# Altium project Test_Bench_Back_Scatter.PrjPcb
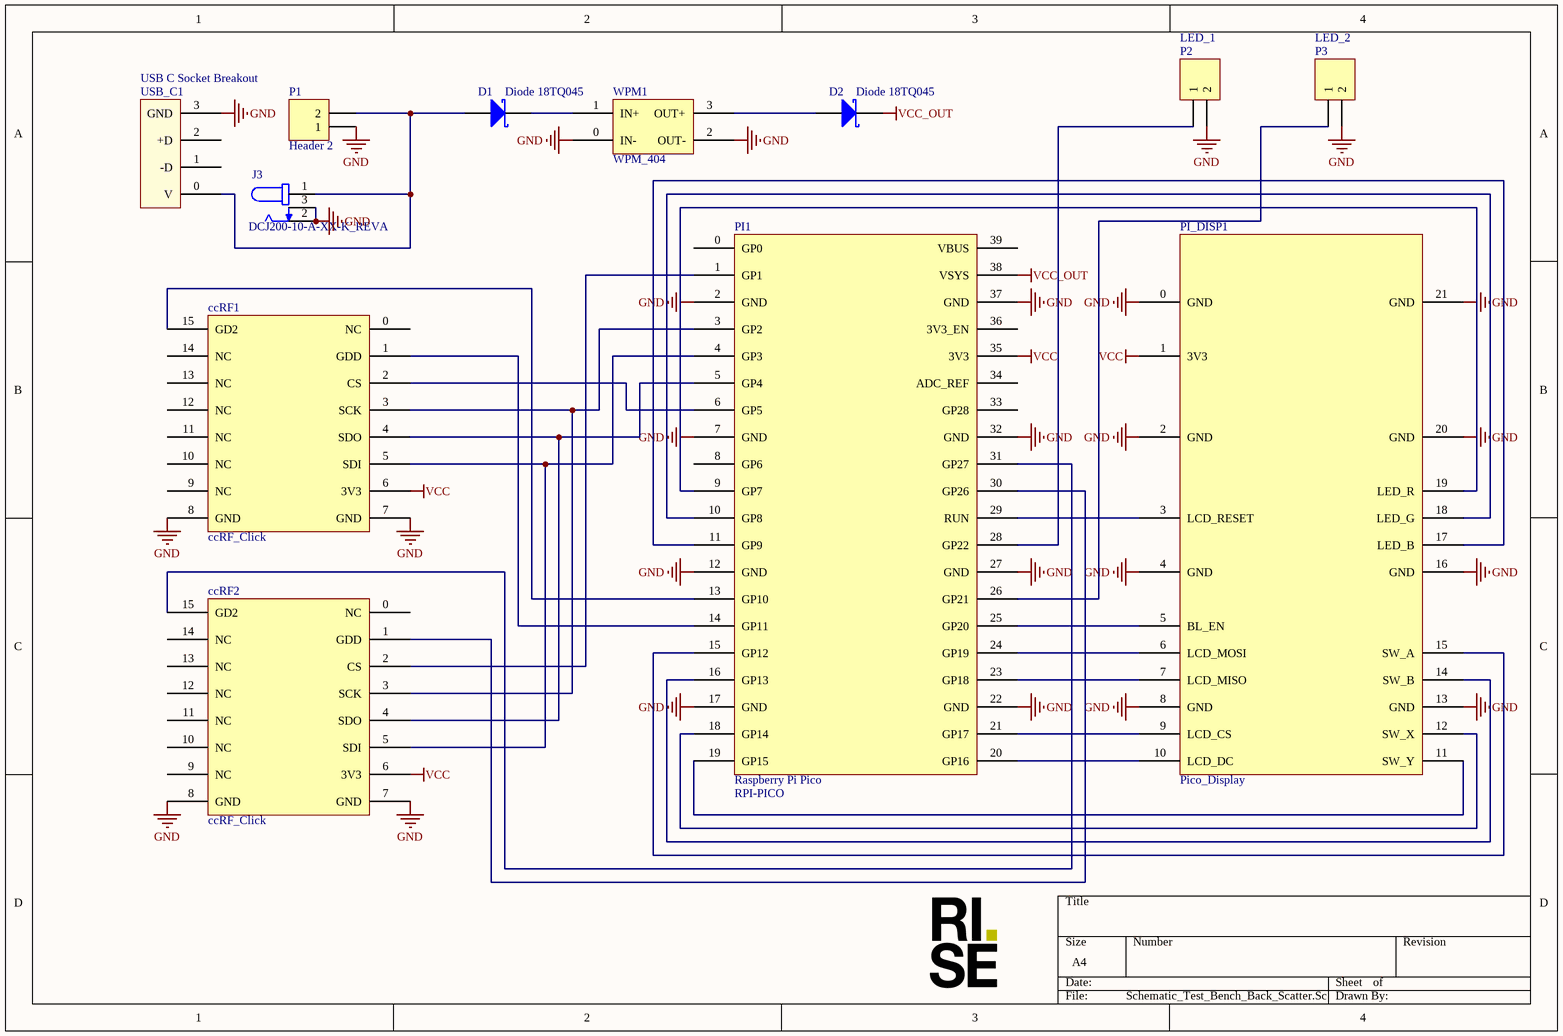
[diagram p0: Schematic_Test_Bench_Back_Scatter.SchDoc]
1 sheet, 13 parts. Net scope: global (net labels, ports and power ports of the same name join across sheets).
Board file: PCB_Test_Bench_Back_Scatter.PcbDoc

## Sheet Schematic_Test_Bench_Back_Scatter.SchDoc
size A4

### Parts
*  RISE_LOGO  [RISE_Logo]  (value not drawn)
ccRF1  ccRF_Click  [CCRF_CLICK_SMD]
ccRF2  ccRF_Click  [CCRF_CLICK_SMD]
D1  Diode 18TQ045  [18TQ045-M3]
D2  Diode 18TQ045  [18TQ045-M3]
J3  DCJ200-10-A-XX-K_REVA  [GCT_DCJ200-10-A-XX-K_REVA]
P1  Header 2  [HDR1X2]
P2  LED_1  [HDR1X2]
P3  LED_2  [HDR1X2]
PI1  Raspberry Pi Pico  Supplier Part Number 1: RPI-PICO  [Raspberry Pi Pico]
PI_DISP1  Pico_Display  [Pico_Display_Header]
USB_C1  USB C Socket Breakout  [Simple_USB_C_Socket_Breakout]
WPM1  WPM_404  [WPM404_SMD]

### Nets
GND: ccRF1.7(GND) ccRF1.8(GND) ccRF2.7(GND) ccRF2.8(GND) J3.2 J3.3 P1.1 P2.2 P3.2 PI1.2(GND) PI1.7(GND) PI1.12(GND) PI1.17(GND) PI1.22(GND) PI1.27(GND) PI1.32(GND) PI1.37(GND) PI_DISP1.0(GND) PI_DISP1.2(GND) PI_DISP1.4(GND) PI_DISP1.8(GND) PI_DISP1.13(GND) PI_DISP1.16(GND) PI_DISP1.20(GND) PI_DISP1.21(GND) USB_C1.3(GND) WPM1.0(IN-) WPM1.2(OUT-)
VCC: ccRF1.6(3V3) ccRF2.6(3V3) PI1.35(3V3) PI_DISP1.1(3V3)
VCC_OUT: D2.1(K) PI1.38(VSYS)
NetccRF1_1: ccRF1.1(GDD) PI1.14(GP11)
NetccRF1_2: ccRF1.2(CS) PI1.6(GP5)
NetccRF1_3: ccRF1.3(SCK) ccRF2.3(SCK) PI1.3(GP2)
NetccRF1_4: ccRF1.4(SDO) ccRF2.4(SDO) PI1.5(GP4)
NetccRF1_5: ccRF1.5(SDI) ccRF2.5(SDI) PI1.4(GP3)
NetccRF1_15: ccRF1.15(GD2) PI1.13(GP10)
NetccRF2_1: ccRF2.1(GDD) PI1.30(GP26)
NetccRF2_2: ccRF2.2(CS) PI1.1(GP1)
NetccRF2_15: ccRF2.15(GD2) PI1.31(GP27)
NetD1_1: D1.1(K) WPM1.1(IN+)
NetD1_3: D1.3(A) J3.1 P1.2 USB_C1.0(V)
NetD2_3: D2.3(A) WPM1.3(OUT+)
NetP2_1: P2.1 PI1.28(GP22)
NetP3_1: P3.1 PI1.26(GP21)
NetPI1_9: PI1.9(GP7) PI_DISP1.19(LED_R)
NetPI1_10: PI1.10(GP8) PI_DISP1.18(LED_G)
NetPI1_11: PI1.11(GP9) PI_DISP1.17(LED_B)
NetPI1_15: PI1.15(GP12) PI_DISP1.15(SW_A)
NetPI1_16: PI1.16(GP13) PI_DISP1.14(SW_B)
NetPI1_18: PI1.18(GP14) PI_DISP1.12(SW_X)
NetPI1_19: PI1.19(GP15) PI_DISP1.11(SW_Y)
NetPI1_20: PI1.20(GP16) PI_DISP1.10(LCD_DC)
NetPI1_21: PI1.21(GP17) PI_DISP1.9(LCD_CS)
NetPI1_23: PI1.23(GP18) PI_DISP1.7(LCD_MISO)
NetPI1_24: PI1.24(GP19) PI_DISP1.6(LCD_MOSI)
NetPI1_25: PI1.25(GP20) PI_DISP1.5(BL_EN)
NetPI1_29: PI1.29(RUN) PI_DISP1.3(LCD_RESET)

Not connected (* = marked no-connect by the designer): ccRF1 0(NC) 9(NC) 10(NC) 11(NC) 12(NC) 13(NC) 14(NC); ccRF2 0(NC) 9(NC) 10(NC) 11(NC) 12(NC) 13(NC) 14(NC); PI1 0(GP0) 8(GP6) 33(GP28) 34(ADC_REF) 36(3V3_EN) 39(VBUS); USB_C1 1(-D) 2(+D)

### Library data of the parts
ccRF1 ccRF2 = ccRF_Click: ccRF_Click 2480MHz radio
D1 D2 = Diode 18TQ045: Schottky Rectifier; Note: Terminal 2 is the TAB and is electrically connected to the cathode; Published: 8-Jun-2000; LatestRevisionDate: 17-Jul-2002; LatestRevisionNote: Re-released for DXP Platform.; DatasheetVersion: Dec-1997; PackageVersion: Feb-1998; PackageReference: TO-220AC; Publisher: Altium Limited; PackageDescription: TO, Thru-Hole, Vertical, Heatsink Mounted; 3 In-Line Leads (1 Absent); Pitch 2.54 mm; ComponentLink1Description: Manufacturer Link; ComponentLink1URL: http://www.irf.com/; ComponentLink2Description: Datasheet; ComponentLink2URL: http://www.irf.com/product-info/datasheets/data/18tq.pdf
J3 = DCJ200-10-A-XX-K_REVA: Power Barrel Connector Jack 2.05mm ID (0.081), 5.50mm OD (0.217) Through Hole, Right Angle; MF: Global Connector Technology; MP: DCJ200-10-A-K1-K; SnapEDA_Link: https://www.snapeda.com/parts/DCJ200-10-A-K1-K/Global+Connector+Technology/view-part/?ref=snap; Package: None; Value: *; Check_prices: https://www.snapeda.com/parts/DCJ200-10-A-K1-K/Global+Connector+Technology/view-part/?ref=eda
P1-P3 = Header 2: Header, 2-Pin; LatestRevisionDate: 17-Jul-2002; LatestRevisionNote: Re-released for DXP Platform.; Publisher: Altium Limited
PI1 = Raspberry_Pi_Pico_Header: Supplier 1: TME
PI_DISP1 = Pico_Display_Header
USB_C1 = USB C Socket Breakout: Simple USB C Socket Breakout
WPM1 = WPM_404: Velleman WPM404 Whadda DC-DC Adjustable Voltage Step-Down Module LM2596S